# Altium schematic sheet Schematic.SchDoc
size A
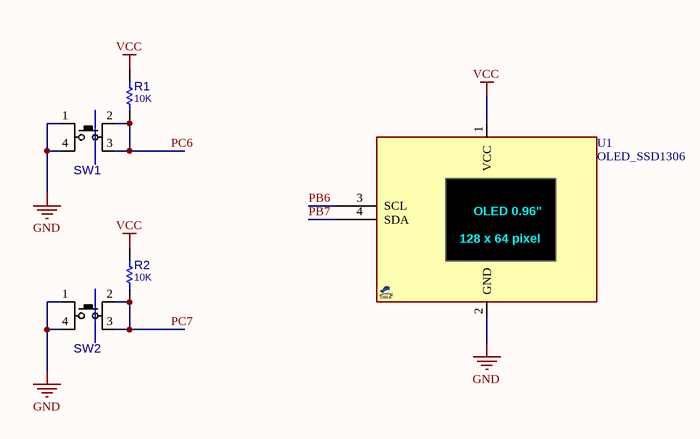
[diagram p0: Schematic.SchDoc]

## Parts
R1  10K  [R0402]
R2  10K  [R0402]
SW1  PUSHBUTTON  [SWPBS_SPDT_3X3TS]  (value not drawn)
SW2  PUSHBUTTON  [SWPBS_SPDT_3X3TS]  (value not drawn)
U1  OLED_SSD1306  [OLED_SSD1306_64_I2C]

## Nets
GND: SW1.1(P1) SW1.4(P2) SW2.1(P1) SW2.4(P2) U1.2(GND)
VCC: R1.2 R2.2 U1.1(VCC)
PB6: U1.3(SCL)
PB7: U1.4(SDA)
PC6: R1.1 SW1.2(P3) SW1.3(P4)
PC7: R2.1 SW2.2(P3) SW2.3(P4)

## Notes on the sheet
- (in symbol OLED_SSD1306_64_I2C) OLED 0.96"; 128 x 64 pixel

## Library data of the parts
R1 R2 = RES_SMD: RESISTOR, SMD; PARAM: -W; DESC: DESCRIPTION; DIST#: MOUSER; PARAM2: 1%; MANF_P#: -; MANF: -; ASSEMBLY: ASSEMBLY; PRICE: 100= 0.5$; VALUE: 10K
SW1 SW2 = SWPBS_SPDT_3X3TS: SWITCH, PUSH BUTTON, TACTILE, SMD, SPDT, 3X3MM; MANF: CHINA; DESC: DESCRIPTION; MANF_P#: TS-1233; VALUE: PUSHBUTTON; ASSEMBLY: ASSEMBLY; PARAM: PARAM; PRICE: 1000= 5$
U1 = OLED_SSD1306_64_I2C: OLED, SSD1306, 0.96", 128X64, BREAKOUT I2C; MANF_P#: OLED_SSD1306_I2C; PARAM2: 3.3/5VCC, -20~70oC; PARAM: 2 Colors, 0.96", 128X64; MANF: -; VALUE: OLED_SSD1306